# EAGLE design Electgpl F883-6 THT Rev1 (EAGLE 7.4.0)
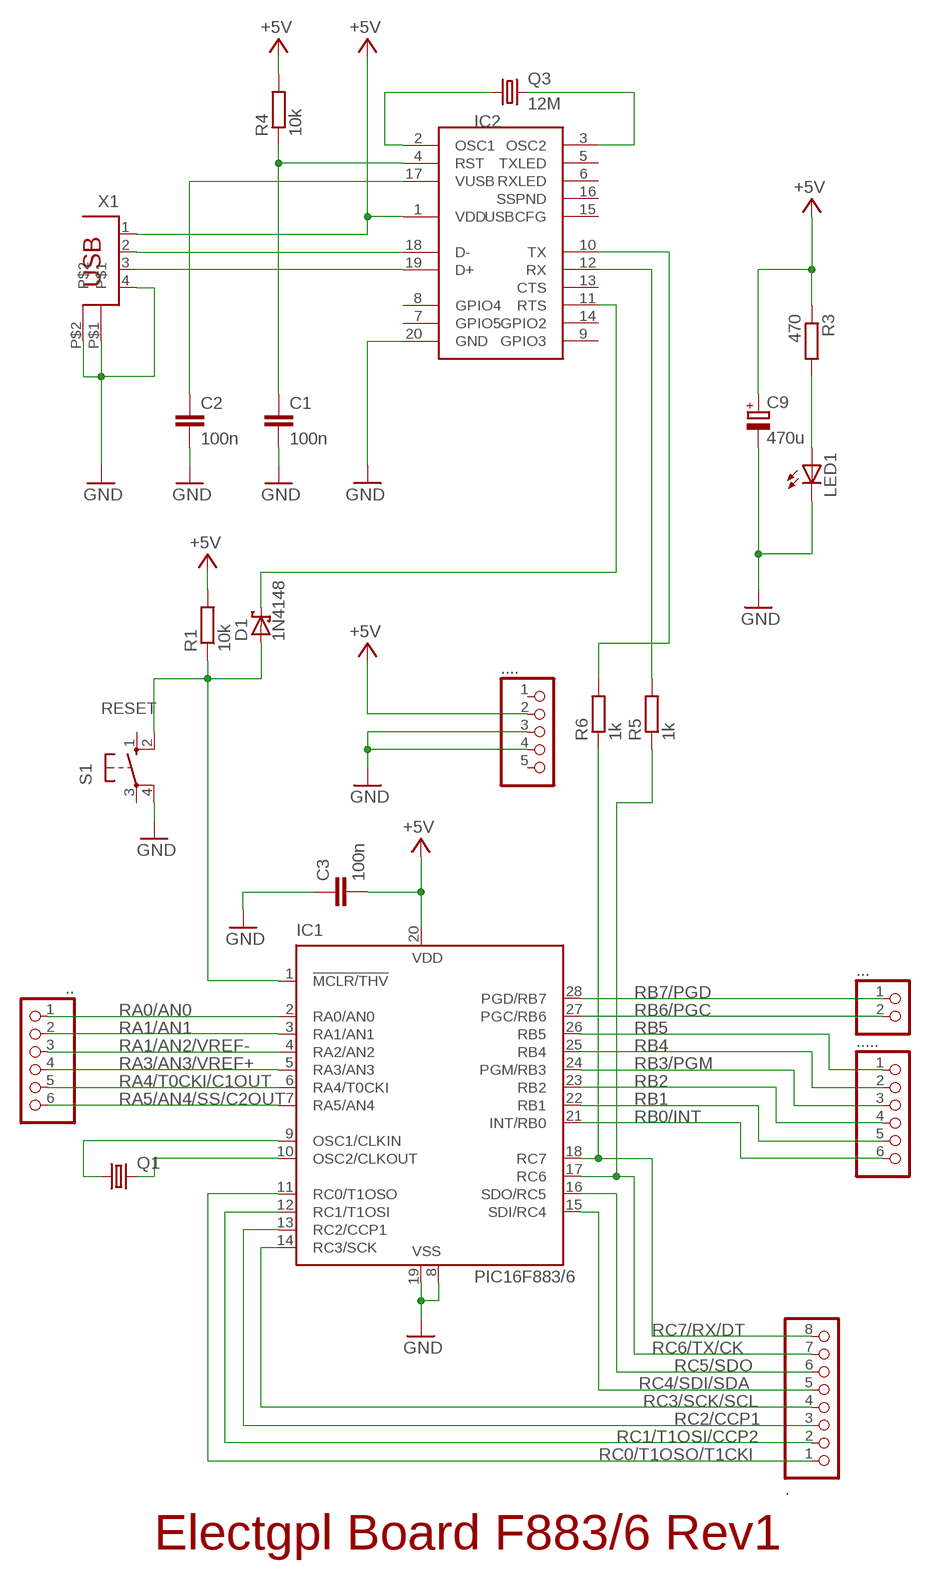
[diagram p0: schematic, sheet 1]

## Parts
.  PINHD-1X8  [1X08]
..  PINHD-1X6  [1X06]
...  PINHD-1X2  [1X02]
....  PINHD-1X5  [1X05]
.....  PINHD-1X6  [1X06]
C1  100n  C-EU025-024X044  [C025-024X044]
C2  100n  C-EU025-024X044  [C025-024X044]
C3  100n  C-EU025-024X044  [C025-024X044]
C9  470u  CPOL-EUE3.5-10  [E3,5-10]
D1  1N4148  SCHOTTKY-DIODEDO35-7  [DO35-7]
IC1  PIC16F883/6  PIC16876P  [DIL28-3]
IC2  MCP2200SOIC20  [SOIC20]
LED1  LED3MM  [LED3MM]
Q1  CRYSTALHC49S  [HC49/S]
Q3  12M  CRYSTALHC49S  [HC49/S]
R1  10k  R-EU_0204/5  [0204/5]
R3  470  R-EU_0204/5  [0204/5]
R4  10k  R-EU_0204/5  [0204/5]
R5  1k  R-EU_0204/5  [0204/5]
R6  1k  R-EU_0204/5  [0204/5]
S1  10-XX  [B3F-10XX]
X1  PN61729  [PN61729]

## Nets
+5V [usbvcc]: .....2 C3.2 C9.+ IC1.20(VDD) IC2.1(VDD) R1.2 R3.1 R4.2 X1.1
GND [gnd]: .....3 .....4 C1.2 C2.2 C3.1 C9.- IC1.8(VSS) IC1.19(VSS) IC2.20(GND) LED1.K(C) S1.4(P1) X1.4 X1.P$1 X1.P$2
N$1: IC1.10(OSC2/CLKOUT) Q1.2
N$2: IC1.9(OSC1/CLKIN) Q1.1
N$7: LED1.A R3.2
N$8: D1.C IC2.11(RTS)
N$9: IC2.18(D-) X1.2
N$12: IC2.12(RX) R5.2
N$13: IC2.10(TX) R6.2
N$14: IC2.19(D+) X1.3
N$17: C1.1 IC2.4(RST) R4.1
N$20: IC2.2(OSC1) Q3.1
N$21: IC2.3(OSC2) Q3.2
N$22: C2.1 IC2.17(VUSB)
RA0/AN0: ...1 IC1.2(RA0/AN0)
RA1/AN1: ...2 IC1.3(RA1/AN1)
RA1/AN2/VREF-: ...3 IC1.4(RA2/AN2)
RA3/AN3/VREF+: ...4 IC1.5(RA3/AN3)
RA4/T0CKI/C1OUT: ...5 IC1.6(RA4/T0CKI)
RA5/AN4/SS/C2OUT: ...6 IC1.7(RA5/AN4)
RB0/INT: ......6 IC1.21(INT/RB0)
RB1: ......5 IC1.22(RB1)
RB2: ......4 IC1.23(RB2)
RB3/PGM: ......3 IC1.24(PGM/RB3)
RB4: ......2 IC1.25(RB4)
RB5: ......1 IC1.26(RB5)
RB6/PGC: ....2 IC1.27(PGC/RB6)
RB7/PGD: ....1 IC1.28(PGD/RB7)
RC0/T1OSO/T1CKI: ..1 IC1.11(RC0/T1OSO)
RC1/T1OSI/CCP2: ..2 IC1.12(RC1/T1OSI)
RC2/CCP1: ..3 IC1.13(RC2/CCP1)
RC3/SCK/SCL: ..4 IC1.14(RC3/SCK)
RC4/SDI/SDA: ..5 IC1.15(SDI/RC4)
RC5/SDO: ..6 IC1.16(SDO/RC5)
RC6/TX/CK: ..7 IC1.17(RC6) R5.1
RC7/RX/DT: ..8 IC1.18(RC7) R6.1
RESET: D1.A IC1.1(!MCLR/THV) R1.1 S1.2(S1)
Unconnected: .....1 .....5 IC2.5(TXLED) IC2.6(RXLED) IC2.7(GPIO5) IC2.8(GPIO4) IC2.9(GPIO3) IC2.13(CTS) IC2.14(GPIO2) IC2.15(USBCFG) IC2.16(SSPND) S1.1(S) S1.3(P)

## Notes on the sheet
- Electgpl Board F883/6 Rev1

## Library data of the parts
. = SmartPrj:PINHD-1X8: PIN HEADER
.. ..... = SmartPrj:PINHD-1X6: PIN HEADER
... = pinhead:PINHD-1X2: PIN HEADER
.... = pinhead:PINHD-1X5: PIN HEADER
C1-C3 = rcl:C-EU: CAPACITOR, European symbol
C9 = rcl:CPOL-EU: POLARIZED CAPACITOR, European symbol
D1 = diode:SCHOTTKY-DIODE: Schottky Diode
IC1 = microchip:PIC16*876: MICROCONTROLLER flash type; OC_FARNELL: unknown; OC_NEWARK: unknown
IC2 = microchip-update-2:MCP2200: USB 2.0 to UART Protocol Converter with GPIO
LED1 = led:LED: LED OSRAM: - CHIPLED LG R971, LG N971, LY N971, LG Q971, LY Q971, LO R971, LY R971 LH N974, LH R974 LS Q976, LO Q976, LY Q976 LO Q996 - Hyper CHIPLED LW Q18S LB Q993, LB Q99A, LB R99A - SideLED LS A670, LO A670, LY A670, LG A670, LP A670 LB A673, LV A673, LT A673, LW A673 LH A674 LY A675 LS A676, LA A676, LO A676, LY A676, LW A676 LS A679, LY A679, LG A679 - Hyper Micro SIDELED® LS Y876, LA Y876, LO Y876, LY Y876 LT Y87S - SmartLED LW L88C, LW L88S LB L89C, LB L89S, LG L890 LS L89K, LO L89K, LY L89K LS L896, LA L896, LO L896, LY L896 - TOPLED LS T670, LO T670, LY T670, LG T670, LP T670 LSG T670, LSP T670, LSY T670, LOP T670, LYG T670 LG T671, LOG T671, LSG T671 LB T673, LV T673, LT T673, LW T673 LH T674 LS T676, LA T676, LO T676, LY T676, LB T676, LH T676, LSB T676, LW T676 LB T67C, LV T67C, LT T67C, LS T67K, LO T67K, LY T67K, LW E67C LS E67B, LA E67B, LO E67B, LY E67B, LB E67C, LV E67C, LT E67C LW T67C LS T679, LY T679, LG T679 LS T770, LO T770, LY T770, LG T770, LP T770 LB T773, LV T773, LT T773, LW T773 LH T774 LS E675, LA E675, LY E675, LS T675 LS T776, LA T776, LO T776, LY T776, LB T776 LHGB T686 LT T68C, LB T68C - Hyper Mini TOPLED® LB M676 - Mini TOPLED Santana® LG M470 LS M47K, LO M47K, LY M47K Source: http://www.osram.convergy.de LUXEON: - LUMILED® LXK2-PW12-R00, LXK2-PW12-S00, LXK2-PW14-U00, LXK2-PW14-V00 LXK2-PM12-R00, LXK2-PM12-S00, LXK2-PM14-U00 LXK2-PE12-Q00, LXK2-PE12-R00, LXK2-PE12-S00, LXK2-PE14-T00, LXK2-PE14-U00 LXK2-PB12-K00, LXK2-PB12-L00, LXK2-PB12-M00, LXK2-PB14-N00, LXK2-PB14-P00, LXK2-PB14-Q00 LXK2-PR12-L00, LXK2-PR12-M00, LXK2-PR14-Q00, LXK2-PR14-R00 LXK2-PD12-Q00, LXK2-PD12-R00, LXK2-PD12-S00 LXK2-PH12-R00, LXK2-PH12-S00 LXK2-PL12-P00, LXK2-PL12-Q00, LXK2-PL12-R00 Source: www.luxeon.com KINGBRIGHT: KA-3528ASYC Source: www.kingbright.com
Q1 Q3 = crystal:CRYSTAL: CRYSTAL; OC_FARNELL: 1667008; OC_NEWARK: unknown
R1 R3-R6 = rcl:R-EU_: RESISTOR, European symbol
S1 = switch-omron:10-XX: OMRON SWITCH; MPN: B3F-1000; OC_FARNELL: 176432; OC_NEWARK: 36M3542
X1 = SmartPrj:PN61729: BERG USB connector

## Net classes
0 default: width 0.254 mm, clearance 0.254 mm
1 power: width 0.61 mm, drill 0.61 mm, clearance 0.254 mm
2 gnd: width 0.305 mm, drill 0.559 mm, clearance 0.254 mm
3 usbvcc: width 0.508 mm, drill 0.61 mm, clearance 0.254 mm
4 aref: width 0.406 mm, drill 0.61 mm, clearance 0.254 mm

## Board
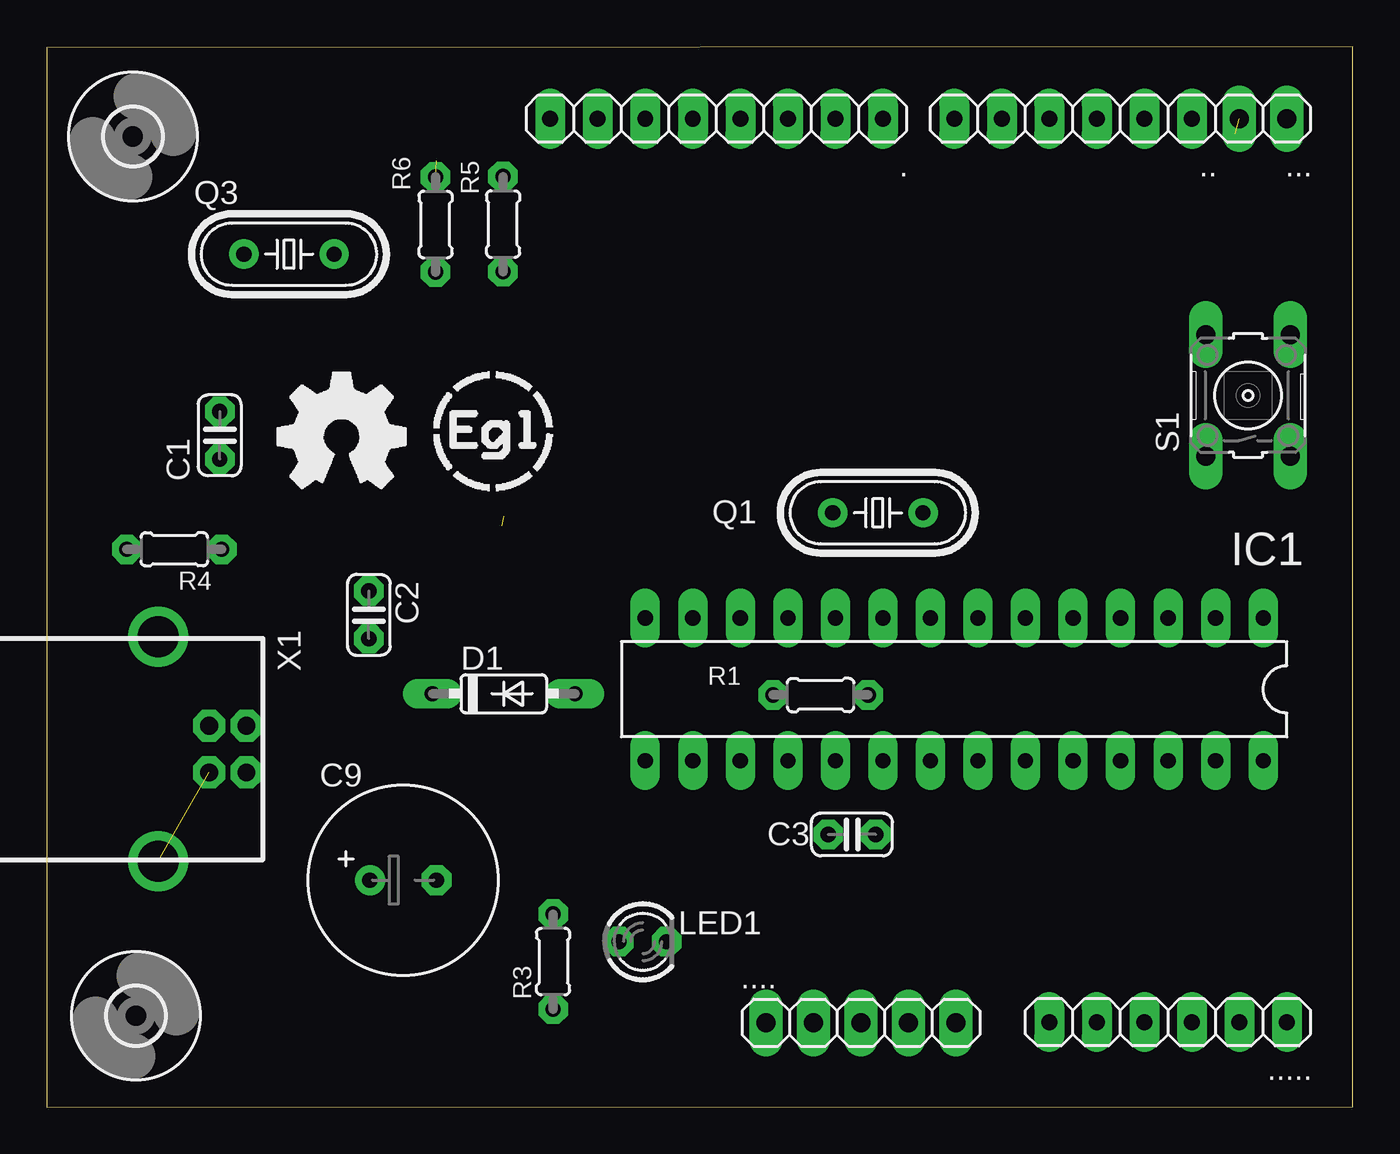
[diagram p1: board, top side]
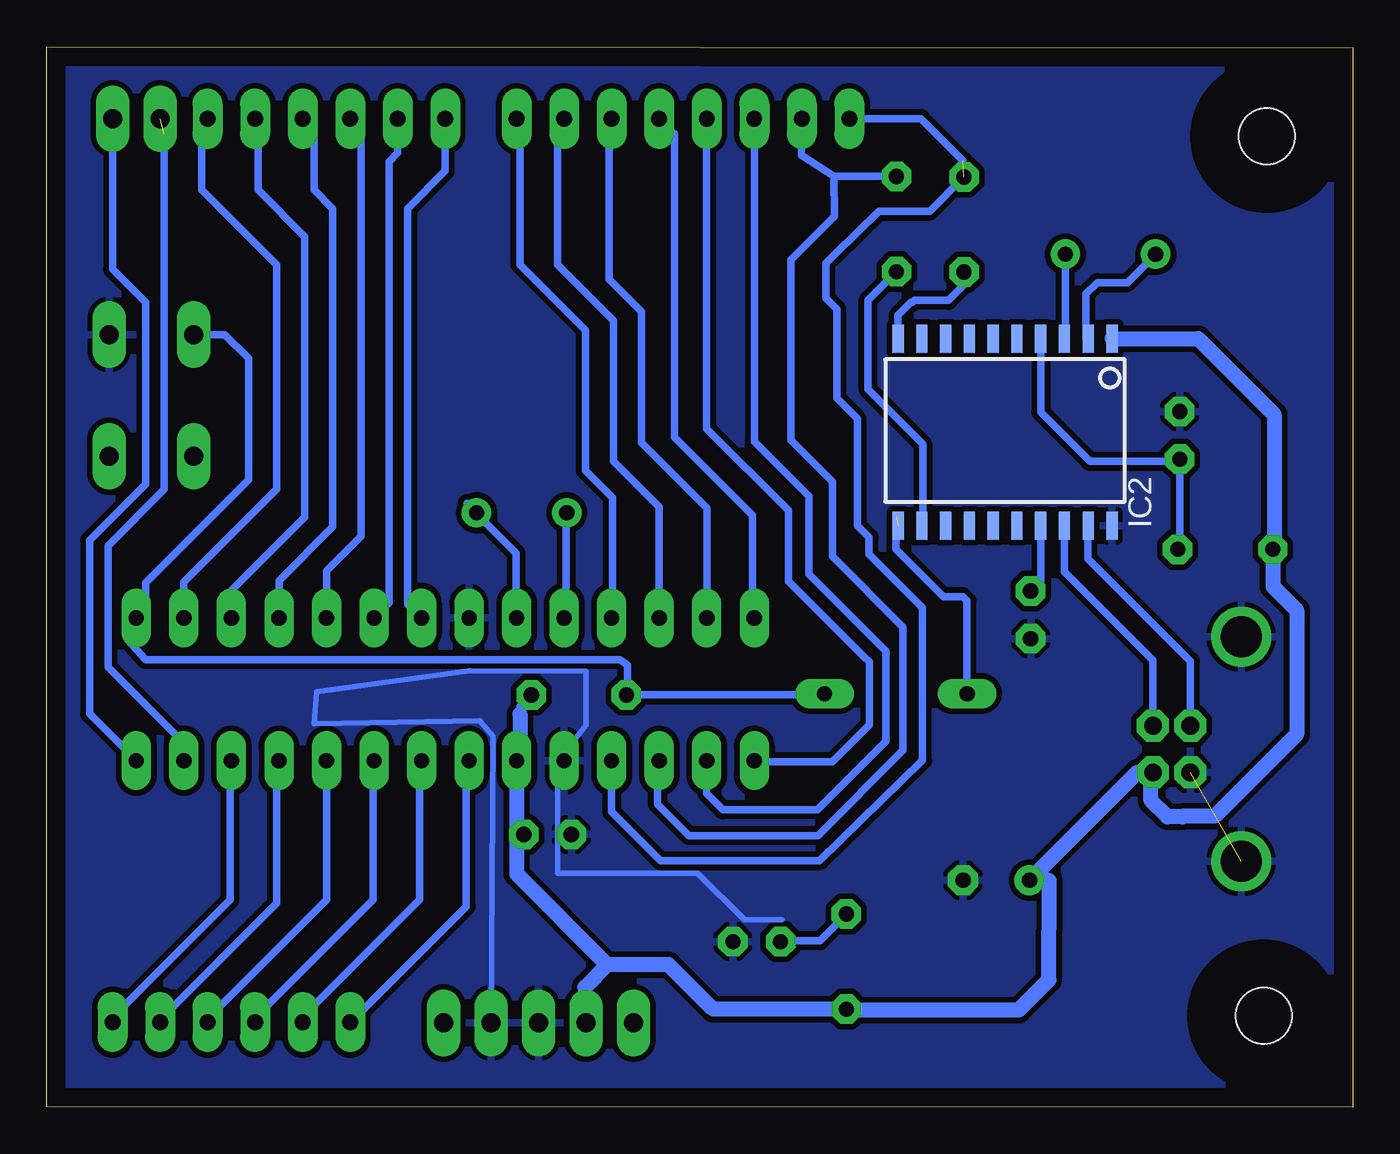
[diagram p2: board, bottom side, seen from below]

Size 69.78 x 56.64 mm. Coordinates in mm from the lower left corner, seen from the top.
Outline: 0,0 69.78,0.01 69.78,56.64 0,56.6 0,0
Copper layers (1*16): Top 0.035mm / dielectric 1.5mm / Bottom 0.035mm
Design rules "default *": minimum track width 16mil, minimum drill 24mil, track to track 12mil, track to pad 12mil, pad to pad 12mil, via to via 12mil, smd to smd 8mil, copper to edge 40mil, drill to drill 8mil, minimum pad ring 15mil, minimum via ring 8mil, stop-mask expansion 4mil, vias tented up to drill 0mil, thermal gap 10mil

### Footprints (pad centres in the part's own frame; a part is rotated, then mirrored left to right if it is on the bottom)
1X08 = drill 0.85 pad 1.422 long: 1 -8.89,0; 2 -6.35,0; 3 -3.81,0; 4 -1.27,0; 5 1.27,0; 6 3.81,0; 7 6.35,0; 8 8.89,0
1X06 = drill 0.85 pad 1.422 long: 1 -6.35,0; 2 -3.81,0; 3 -1.27,0; 4 1.27,0; 5 3.81,0; 6 6.35,0
1X02 = drill 1.016 long: 1 -1.27,0; 2 1.27,0
1X05 = drill 1.016 long: 1 -5.08,0; 2 -2.54,0; 3 0,0; 4 2.54,0; 5 5.08,0
C025-024X044 = drill 0.813 octagon: 1 -1.27,0; 2 1.27,0
E3,5-10 = drill 0.813 pad 1.6: + -1.778,0 | drill 0.813 pad 1.6 octagon: - 1.778,0
DO35-7 = drill 0.813 long: A 3.81,0; C -3.81,0
DIL28-3 = drill 0.813 long: 1 -16.51,-3.81; 2 -13.97,-3.81; 3 -11.43,-3.81; 4 -8.89,-3.81; 5 -6.35,-3.81; 6 -3.81,-3.81; 7 -1.27,-3.81; 8 1.27,-3.81; 9 3.81,-3.81; 10 6.35,-3.81; 11 8.89,-3.81; 12 11.43,-3.81; 13 13.97,-3.81; 14 16.51,-3.81; 15 16.51,3.81; 16 13.97,3.81; 17 11.43,3.81; 18 8.89,3.81; 19 6.35,3.81; 20 3.81,3.81; 21 1.27,3.81; 22 -1.27,3.81; 23 -3.81,3.81; 24 -6.35,3.81; 25 -8.89,3.81; 26 -11.43,3.81; 27 -13.97,3.81; 28 -16.51,3.81
SOIC20 = smd 0.6 x 1.5: 1 -5.715,-5; 2 -4.445,-5; 3 -3.175,-5; 4 -1.905,-5; 5 -0.635,-5; 6 0.635,-5; 7 1.905,-5; 8 3.175,-5; 9 4.445,-5; 10 5.715,-5; 11 5.715,5; 12 4.445,5; 13 3.175,5; 14 1.905,5; 15 0.635,5; 16 -0.635,5; 17 -1.905,5; 18 -3.175,5; 19 -4.445,5; 20 -5.715,5
LED3MM = drill 0.813 octagon: A -1.27,0; K 1.27,0
HC49/S = drill 0.813: 1 -2.413,0; 2 2.413,0
0204/5 = drill 0.813 octagon: 1 -2.54,0; 2 2.54,0
B3F-10XX = drill 1.016 long: 1 -3.251,2.261; 2 3.251,2.261; 3 -3.251,-2.261; 4 3.251,-2.261
3,0 = hole 3: 0,0
PN61729 = drill 0.95 pad 1.676 octagon: 1 1.25,4.71; 2 -1.25,4.71; 3 -1.25,2.71; 4 1.25,2.71 | drill 2.2: P$1 -6,0; P$2 6,0

### Placement (x,y rotation side)
.  35.79,52.8 180 top
..  54.84,52.8 180 top
...  65,52.8 180 top
....  43.5,4.5 0 top
.....  59.92,4.54 180 top
C1  9.24,35.89 90 top
C2  17.21,26.3 270 top
C3  43.02,14.57 0 top
C9  19.04,12.12 0 top
D1  24.42,22.08 0 top
IC1  48.49,22.32 180 top
IC2  18.58,36.05 180 bottom
LED1  31.85,8.84 0 top
Q1  44.41,31.75 180 top
Q3  12.94,45.56 0 top
R1  41.35,22.02 0 top
R3  27.05,7.77 90 top
R4  6.81,29.8 180 top
R5  24.38,47.17 270 top
R6  20.77,47.15 270 top
S1  64.19,38.02 90 top
U$2  [3,0]  4.6,51.85 0 top
U$3  [3,0]  4.76,4.88 0 top
X1  5.96,19.13 270 top

### Tracks (layer width: path | path; a pad name or v marks a point on that pad's centre or on a via)
+5V
  Bottom 0.406: 44.5,18.69 IC1.20 | 41.03,4.57 .....2 | 44.68,13.84 44.61,13.91 44.56,13.86 C3.2 | 4.2,29.87 R4.2 | 10.79,17.76 X1.1 11.51,17.88 | 27,5.18 R3.1 | 44.5,21 44.5,21.41 R1.2
  Bottom 0.813: 44.5,21 44.5,18.69 | 39.83,7.61 36.56,7.61 34.18,5.23 R3.1 | 39.83,7.61 41.03,6.41 41.03,4.57 | IC1.20 44.68,13.84 44.68,12.46 39.83,7.61 | IC2.1 8.26,41.05 4.2,36.99 4.2,29.87 | R4.2 4.27,27.82 3,26.55 3,19.91 7.37,15.54 9.04,15.54 9.08,15.5 9.91,15.5 10.79,16.38 10.79,17.76 | 11.51,17.88 C9.+ 16.21,12.11 16.23,6.8 17.85,5.18 27,5.18
GND  (1 unrouted)
  Bottom 0.305: 30.5,10 32.5,10 35,12.5 42.5,12.5 42.5,18.5 40.97,20.39 40.97,22.89 40.96,23.29 47.2,23.3 55.36,22.2 55.49,20.47 46.62,20.64 46.62,20.61 45.95,19.8 .....4
  pour Bottom: 0.13,56.46 69.71,56.46 69.66,-0.08 0.15,-0.14
N$1
  Bottom 0.406: IC1.10 42.04,26.18 42.04,31.76 42.15,31.65 Q1.2
N$2
  Bottom 0.406: IC1.9 44.7,26.18 44.7,29.58 46.77,31.65 Q1.1 47.33,32.26
N$7
  Bottom 0.406: R3.2 28.47,8.88 30.53,8.88 LED1.A
N$8  (1 unrouted)
  Bottom 0.406: D1.C 20.61,27.05 20.83,27.27 21.86,27.27 24.4,29.8 24.4,31.56
N$9
  Bottom 0.406: X1.2 10.67,23.87 15.4,28.6 IC2.18
N$12
  Bottom 0.406: IC2.12 22.98,31.09 22.98,35.42 25.9,38.34 25.9,43.11 R5.2
N$13
  Bottom 0.406: IC2.10 24.3,42.3 23.6,42.99 23.54,42.99 23.43,43.1 21.59,43.1 20.77,43.92 R6.2
N$14
  Bottom 0.406: X1.3 8.67,23.82 14.15,29.3 14.15,31.03 IC2.19
N$17
  Bottom 0.406: IC2.4 16.67,37.12 14.05,34.5 9.36,34.5 C1.1 9.24,29.91 R4.1
N$20
  Bottom 0.406: IC2.2 14.25,41.05 14.25,43.45 13.65,44.05 12.04,44.05 Q3.1
N$21
  Bottom 0.406: IC2.3 15.36,41.05 Q3.2
N$22
  Bottom 0.406: IC2.17 16.67,28.1 C2.1
RA0/AN0
  Bottom 0.406: IC1.2 62.46,28.04 57.5,33 57.5,45 61.5,49 61.5,52.49 ...1
RA1/AN1
  Bottom 0.406: IC1.3 59.92,27.58 56,31.5 56,46.5 58.5,49 58.5,52.65 ...2
RA1/AN2/VREF-
  Bottom 0.406: IC1.4 57.38,28.12 54.5,31 54.5,48 55.5,49 55.5,52.19 ...3
RA3/AN3/VREF+
  Bottom 0.406: 53.42,52.67 ...4 53,52.73 53,30.5 54.84,28.66 IC1.5
RA4/T0CKI/C1OUT
  Bottom 0.406: IC1.6 51.5,26.93 51.5,50.5 51.03,50.97 ...5
RA5/AN4/SS/C2OUT
  Bottom 0.406: ...6 48.49,50.01 50.5,48 50.5,26.87 IC1.7
RB0/INT
  Bottom 0.406: IC1.21 47.37,18.36 47.37,10.71 53.42,4.67 ......6
RB1
  Bottom 0.406: IC1.22 49.86,18.36 49.86,11.07 56.26,4.67 ......5
RB2
  Bottom 0.406: IC1.23 52.35,18.36 52.35,11.07 58.75,4.67 ......4
RB3/PGM
  Bottom 0.406: IC1.24 54.84,11.07 61.24,4.67 ......3
RB4
  Bottom 0.406: IC1.25 57.51,18.36 57.51,10.89 63.73,4.67 ......2
RB5
  Bottom 0.406: IC1.26 60,18.36 60,11.07 66.4,4.67 ......1
RB6/PGC  (1 unrouted)
  Bottom 0.406: IC1.27 62.51,19.51 66.5,23.5 66.5,30 63.5,33 63.5,52
RB7/PGD
  Bottom 0.406: ....1 66.27,44.77 64.5,43 64.5,33.28 67.5,30.28 67.5,21 65.5,19 65.49,19 IC1.28
RC0/T1OSO/T1CKI
  Bottom 0.406: IC1.11 39.55,26.18 39.55,32.55 41,34 41,41.5 44.5,45 44.5,52.62 ..1 44.7,52.67
RC1/T1OSI/CCP2
  Bottom 0.406: IC1.12 37.06,32.06 39.5,34.5 39.5,42 42.5,45 42.5,52.44 ..2
RC2/CCP1
  Bottom 0.406: 34.57,26.18 IC1.13 34.5,26.15 34.5,32 38,35.5 38,42.5 39.74,44.23 39.73,52.67 ..3
RC3/SCK/SCL
  Bottom 0.406: IC1.14 32.08,26.18 32.08,31.61 36.24,35.77 36.24,51.99 37.06,52.67 ..4
RC4/SDI/SDA
  Bottom 0.406: ..5 34.52,36.24 30.15,31.87 30.15,28.09 26.11,24.05 25.84,23.79 25.84,20.42 27.79,18.46 31.93,18.46 IC1.15
RC5/SDO
  Bottom 0.406: ..6 31.98,35.55 29.06,32.62 29.06,28.48 24.93,24.35 24.93,19.55 28.61,15.88 33.66,15.88 34.52,16.77 IC1.16
RC6/TX/CK
  Bottom 0.406: 27.71,49.72 29.45,50.84 ..7 | 27.71,49.72 27.69,47.58 30.02,45.26 30.02,35.61 27.81,33.41 27.81,29.42 24.02,25.64 24.02,19.06 28.58,14.51 35.48,14.51 37.15,16.19 37.15,18.42 IC1.17 | 27.71,49.72 24.39,49.72 R5.1
RC7/RX/DT  (1 unrouted)
  Bottom 0.406: 20.82,50.56 23.06,52.8 ..8 | IC1.18 39.6,15.77 37,13.16 28.49,13.16 22.99,18.52 22.99,26.67 25.85,29.52 25.85,30.44 26.47,31.06 26.47,36.77 27.57,37.87 27.57,42.62 28.15,43.2 28.15,45.07 27.67,45.55 25.31,47.86 22.6,47.86 R6.1
RESET
  Bottom 0.406: S1.2 60.27,41.27 59,40 59,33.5 64.5,28 64.5,26.63 IC1.1 65.5,25.63 65.5,25 64.5,23.91 39.14,23.91 38.76,23.62 38.76,22.07 R1.1 28.33,22.02 D1.A

### Text on the board
Name: RC7 | RC6 | RC5 | RC4 | RC3 | RC2 | RC1 | RC0 | RA5 | RA4 | RA3 | RA2 | RA1 | RA0 | RB6 | RB7 | INDUSTRIA ARGENTINA | RESET | Electgpl | 883/6 | POWER | GND | GND | +5V | RB0 | RB1 | RB2 | RB3 | RB4 | RB5